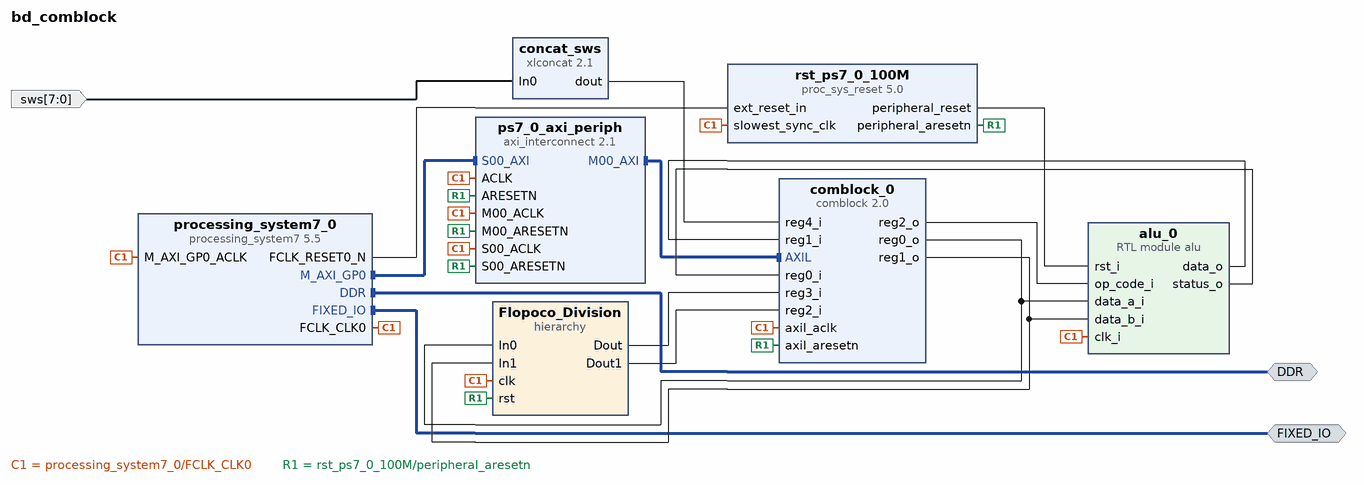
[diagram p0: block diagram of the top level]
# Vivado block design bd_comblock, xc7z020clg484-1, Vivado 2022.2
create_bd_design bd_comblock

create_bd_intf_port -mode Master -vlnv xilinx.com:interface:ddrx_rtl:1.0 DDR
create_bd_intf_port -mode Master -vlnv xilinx.com:display_processing_system7:fixedio_rtl:1.0 FIXED_IO
create_bd_port -dir I -from 7 -to 0 sws

create_bd_cell -type ip -vlnv xilinx.com:ip:processing_system7:5.5 processing_system7_0
set_property -dict [list \
  CONFIG.PCW_APU_PERIPHERAL_FREQMHZ 666.666667 \
  CONFIG.PCW_ENET0_ENET0_IO {MIO 16 .. 27} \
  CONFIG.PCW_ENET0_GRP_MDIO_ENABLE 1 \
  CONFIG.PCW_ENET0_GRP_MDIO_IO {MIO 52 .. 53} \
  CONFIG.PCW_ENET0_PERIPHERAL_ENABLE 1 \
  CONFIG.PCW_ENET0_RESET_ENABLE 0 \
  CONFIG.PCW_ENET_RESET_ENABLE 1 \
  CONFIG.PCW_ENET_RESET_SELECT {Share reset pin} \
  CONFIG.PCW_FPGA0_PERIPHERAL_FREQMHZ 100.000000 \
  CONFIG.PCW_FPGA1_PERIPHERAL_FREQMHZ 150.000000 \
  CONFIG.PCW_FPGA2_PERIPHERAL_FREQMHZ 50.000000 \
  CONFIG.PCW_GPIO_MIO_GPIO_ENABLE 1 \
  CONFIG.PCW_GPIO_MIO_GPIO_IO MIO \
  CONFIG.PCW_I2C_RESET_ENABLE 1 \
  CONFIG.PCW_PRESET_BANK1_VOLTAGE {LVCMOS 1.8V} \
  CONFIG.PCW_QSPI_PERIPHERAL_ENABLE 0 \
  CONFIG.PCW_SD0_GRP_CD_ENABLE 1 \
  CONFIG.PCW_SD0_GRP_CD_IO {MIO 47} \
  CONFIG.PCW_SD0_GRP_WP_ENABLE 1 \
  CONFIG.PCW_SD0_GRP_WP_IO {MIO 46} \
  CONFIG.PCW_SD0_PERIPHERAL_ENABLE 1 \
  CONFIG.PCW_SD0_SD0_IO {MIO 40 .. 45} \
  CONFIG.PCW_SDIO_PERIPHERAL_FREQMHZ 50 \
  CONFIG.PCW_UART1_PERIPHERAL_ENABLE 1 \
  CONFIG.PCW_UART1_UART1_IO {MIO 48 .. 49} \
  CONFIG.PCW_UART_PERIPHERAL_FREQMHZ 50 \
  CONFIG.PCW_UIPARAM_DDR_FREQ_MHZ 533.333313 \
  CONFIG.PCW_UIPARAM_DDR_PARTNO {MT41J128M16 HA-15E} \
  CONFIG.PCW_USB0_PERIPHERAL_ENABLE 0 \
  CONFIG.PCW_USB0_RESET_ENABLE 0 \
  CONFIG.PCW_USB_RESET_ENABLE 1 \
  CONFIG.preset ZedBoard \
] [get_bd_cells processing_system7_0]
# 221 more settings of processing_system7_0 are not shown: defaults, MIO pin electricals, DDR timing, and values the tool derives
create_bd_cell -type ip -vlnv www.ictp.it:user:comblock:2.0 comblock_0
set_property -dict [list \
  CONFIG.DRAM_IO_ENA false \
  CONFIG.FIFO_IN_ENA false \
  CONFIG.REGS_IN_DEPTH 5 \
  CONFIG.REGS_OUT_DEPTH 3 \
] [get_bd_cells comblock_0]
create_bd_cell -type ip -vlnv xilinx.com:ip:axi_interconnect:2.1 ps7_0_axi_periph
set_property -dict {CONFIG.NUM_MI 1} [get_bd_cells ps7_0_axi_periph]
create_bd_cell -type ip -vlnv xilinx.com:ip:proc_sys_reset:5.0 rst_ps7_0_100M
create_bd_cell -type ip -vlnv xilinx.com:ip:xlconcat:2.1 concat_sws
set_property -dict {CONFIG.IN0_WIDTH 8 CONFIG.IN1_WIDTH 1 CONFIG.NUM_PORTS 1} [get_bd_cells concat_sws]
create_bd_cell -type hier Flopoco_Division
create_bd_cell -type module -reference alu alu_0
set_property -dict {CONFIG.WIDTH 32} [get_bd_cells alu_0]

# ---- hierarchy /Flopoco_Division ----
current_bd_instance /Flopoco_Division
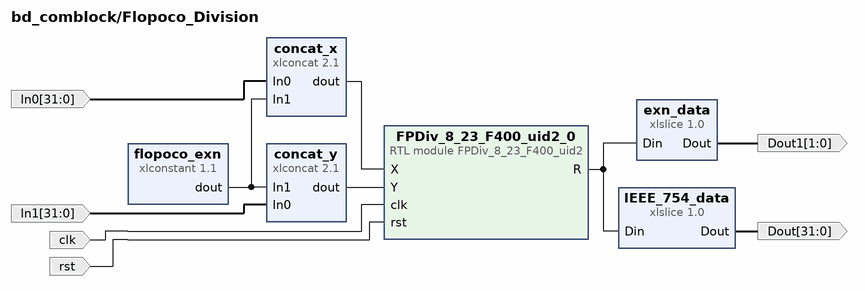
[diagram p1: block diagram inside /Flopoco_Division]
create_bd_pin -dir O -from 31 -to 0 Dout
create_bd_pin -dir O -from 1 -to 0 Dout1
create_bd_pin -dir I -from 31 -to 0 In0
create_bd_pin -dir I -from 31 -to 0 In1
create_bd_pin -dir I -type clk clk
create_bd_pin -dir I -type rst rst

create_bd_cell -type ip -vlnv xilinx.com:ip:xlslice:1.0 IEEE_754_data
set_property -dict {CONFIG.DIN_FROM 31 CONFIG.DIN_WIDTH 34} [get_bd_cells IEEE_754_data]
create_bd_cell -type ip -vlnv xilinx.com:ip:xlslice:1.0 exn_data
set_property -dict {CONFIG.DIN_FROM 33 CONFIG.DIN_TO 32 CONFIG.DIN_WIDTH 34} [get_bd_cells exn_data]
create_bd_cell -type ip -vlnv xilinx.com:ip:xlconcat:2.1 concat_x
set_property -dict {CONFIG.IN0_WIDTH 32 CONFIG.IN1_WIDTH 2} [get_bd_cells concat_x]
create_bd_cell -type ip -vlnv xilinx.com:ip:xlconcat:2.1 concat_y
set_property -dict {CONFIG.IN0_WIDTH 32 CONFIG.IN1_WIDTH 2} [get_bd_cells concat_y]
create_bd_cell -type ip -vlnv xilinx.com:ip:xlconstant:1.1 flopoco_exn
set_property -dict {CONFIG.CONST_WIDTH 2} [get_bd_cells flopoco_exn]
create_bd_cell -type module -reference FPDiv_8_23_F400_uid2 FPDiv_8_23_F400_uid2_0

# ---- connections ----

current_bd_instance /Flopoco_Division
connect_bd_net [get_bd_pins FPDiv_8_23_F400_uid2_0/R] [get_bd_pins IEEE_754_data/Din] [get_bd_pins exn_data/Din]
connect_bd_net [get_bd_pins IEEE_754_data/Dout] [get_bd_pins Dout]
connect_bd_net -net comblock_0_reg0_o [get_bd_pins In0] [get_bd_pins concat_x/In0]
connect_bd_net -net comblock_0_reg1_o [get_bd_pins In1] [get_bd_pins concat_y/In0]
connect_bd_net [get_bd_pins concat_x/dout] [get_bd_pins FPDiv_8_23_F400_uid2_0/X]
connect_bd_net [get_bd_pins concat_y/dout] [get_bd_pins FPDiv_8_23_F400_uid2_0/Y]
connect_bd_net [get_bd_pins exn_data/Dout] [get_bd_pins Dout1]
connect_bd_net [get_bd_pins flopoco_exn/dout] [get_bd_pins concat_y/In1] [get_bd_pins concat_x/In1]
connect_bd_net -net processing_system7_0_FCLK_CLK0 [get_bd_pins clk] [get_bd_pins FPDiv_8_23_F400_uid2_0/clk]
connect_bd_net -net rst_ps7_0_100M_peripheral_aresetn [get_bd_pins rst] [get_bd_pins FPDiv_8_23_F400_uid2_0/rst]

current_bd_instance /
connect_bd_intf_net [get_bd_intf_ports DDR] [get_bd_intf_pins processing_system7_0/DDR]
connect_bd_intf_net [get_bd_intf_ports FIXED_IO] [get_bd_intf_pins processing_system7_0/FIXED_IO]
connect_bd_intf_net [get_bd_intf_pins processing_system7_0/M_AXI_GP0] [get_bd_intf_pins ps7_0_axi_periph/S00_AXI]
connect_bd_intf_net [get_bd_intf_pins ps7_0_axi_periph/M00_AXI] [get_bd_intf_pins comblock_0/AXIL]
connect_bd_net -net IEEE_754_data_Dout [get_bd_pins Flopoco_Division/Dout] [get_bd_pins comblock_0/reg3_i]
connect_bd_net -net In0_0_1 [get_bd_ports sws] [get_bd_pins concat_sws/In0]
connect_bd_net [get_bd_pins alu_0/data_o] [get_bd_pins comblock_0/reg1_i]
connect_bd_net [get_bd_pins alu_0/status_o] [get_bd_pins comblock_0/reg0_i]
connect_bd_net [get_bd_pins comblock_0/reg0_o] [get_bd_pins Flopoco_Division/In0] [get_bd_pins alu_0/data_a_i]
connect_bd_net [get_bd_pins comblock_0/reg1_o] [get_bd_pins Flopoco_Division/In1] [get_bd_pins alu_0/data_b_i]
connect_bd_net [get_bd_pins comblock_0/reg2_o] [get_bd_pins alu_0/op_code_i]
connect_bd_net [get_bd_pins concat_sws/dout] [get_bd_pins comblock_0/reg4_i]
connect_bd_net -net exn_data_Dout [get_bd_pins Flopoco_Division/Dout1] [get_bd_pins comblock_0/reg2_i]
connect_bd_net [get_bd_pins processing_system7_0/FCLK_CLK0] \
  [get_bd_pins processing_system7_0/M_AXI_GP0_ACLK] [get_bd_pins ps7_0_axi_periph/S00_ACLK] \
  [get_bd_pins rst_ps7_0_100M/slowest_sync_clk] [get_bd_pins comblock_0/axil_aclk] [get_bd_pins ps7_0_axi_periph/M00_ACLK] \
  [get_bd_pins ps7_0_axi_periph/ACLK] [get_bd_pins Flopoco_Division/clk] [get_bd_pins alu_0/clk_i]
connect_bd_net [get_bd_pins processing_system7_0/FCLK_RESET0_N] [get_bd_pins rst_ps7_0_100M/ext_reset_in]
connect_bd_net [get_bd_pins rst_ps7_0_100M/peripheral_aresetn] \
  [get_bd_pins ps7_0_axi_periph/S00_ARESETN] [get_bd_pins comblock_0/axil_aresetn] [get_bd_pins ps7_0_axi_periph/M00_ARESETN] \
  [get_bd_pins ps7_0_axi_periph/ARESETN] [get_bd_pins Flopoco_Division/rst]
connect_bd_net [get_bd_pins rst_ps7_0_100M/peripheral_reset] [get_bd_pins alu_0/rst_i]

# ---- address map ----
assign_bd_address -offset 0x43C00000 -range 64K -target_address_space [get_bd_addr_spaces processing_system7_0/Data] [get_bd_addr_segs comblock_0/AXIL/AXIL]

validate_bd_design
save_bd_design
